# EAGLE design I2C-OneWire_Probes (EAGLE 9.6.2)
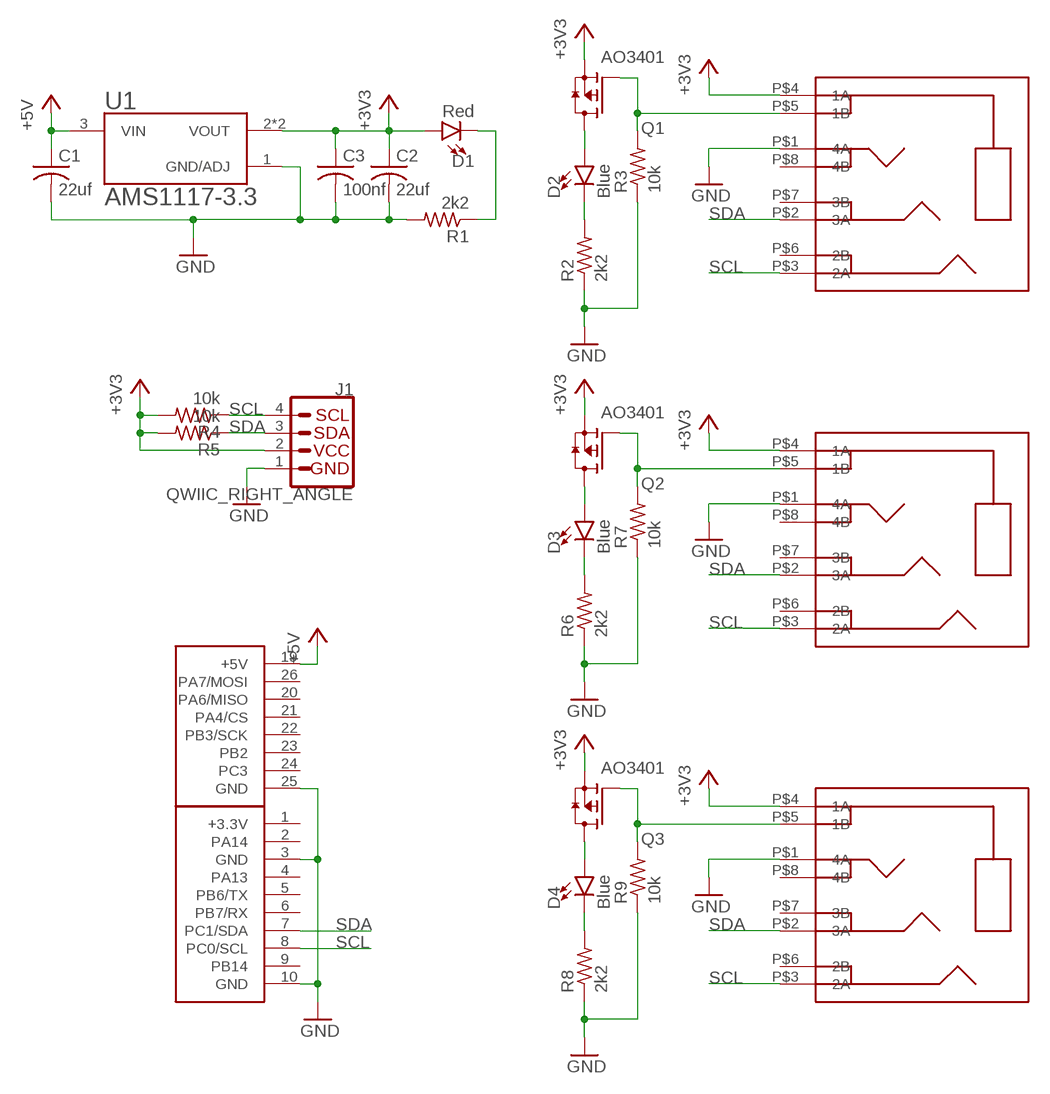
[diagram p0: schematic, sheet 1]

## Parts
C1  22uf  C-USC3216  [C3216]
C2  22uf  C-USC3216  [C3216]
C3  100nf  C-USC0805  [C0805]
D1  Red  LED-RED1206  [LED-1206]
D2  Blue  LED-BLUE1206  [LED-1206]
D3  Blue  LED-BLUE1206  [LED-1206]
D4  Blue  LED-BLUE1206  [LED-1206]
J1  QWIIC_RIGHT_ANGLE  QWIIC_CONNECTORJS-1MM  [JST04_1MM_RA]
Q1  AO3401  [AO3401]
Q2  AO3401  [AO3401]
Q3  AO3401  [AO3401]
R1  2k2  R-US_R0805  [R0805]
R2  2k2  R-US_R0805  [R0805]
R3  10k  R-US_R0805  [R0805]
R4  10k  R-US_R0805  [R0805]
R5  10k  R-US_R0805  [R0805]
R6  2k2  R-US_R0805  [R0805]
R7  10k  R-US_R0805  [R0805]
R8  2k2  R-US_R0805  [R0805]
R9  10k  R-US_R0805  [R0805]
U1  AMS1117-3.3  [SOT229P700X180-4N]
U$1  BOTH-SMD  [BOTH-SMD]
U$2  PJ-3938PJ  [PJ-3938PJ]
U$3  PJ-3938PJ  [PJ-3938PJ]
U$4  PJ-3938PJ  [PJ-3938PJ]

## Nets
+3V3: C2.1 C3.1 D1.A J1.2 Q1.2(S) Q2.2(S) Q3.2(S) R4.2 R5.2 U1.2(VOUT) U1.4(VOUT) U$2.P$4(1A) U$3.P$4(1A) U$4.P$4(1A)
+5V: C1.1 U1.3(VIN) U$1.19(+5V)
GND: C1.2 C2.2 C3.2 J1.1 R1.2 R2.1 R3.1 R6.1 R7.1 R8.1 R9.1 U1.1(GND/ADJ) U$1.3(GND) U$1.10(GND) U$1.25(GND) U$2.P$1(4A) U$3.P$1(4A) U$4.P$1(4A)
N$1: D2.A Q1.3(D)
N$2: D2.C R2.2
N$3: Q1.1(G) R3.2 U$2.P$5(1B)
N$5: D3.C R6.2
N$6: Q2.1(G) R7.2 U$3.P$5(1B)
N$8: D4.C R8.2
N$9: Q3.1(G) R9.2 U$4.P$5(1B)
N$10: D1.C R1.1
N$11: D3.A Q2.3(D)
N$12: D4.A Q3.3(D)
SCL: J1.4 R4.1 U$1.8(PC0/SCL) U$2.P$3(2A) U$3.P$3(2A) U$4.P$3(2A)
SDA: J1.3 R5.1 U$1.7(PC1/SDA) U$2.P$2(3A) U$3.P$2(3A) U$4.P$2(3A)
Unconnected: U$1.1(+3.3V) U$1.2(PA14) U$1.4(PA13) U$1.5(PB6/TX) U$1.6(PB7/RX) U$1.9(PB14) U$1.20(PA6/MISO) U$1.21(PA4/CS) U$1.22(PB3/SCK) U$1.23(PB2) U$1.24(PC3) U$1.26(PA7/MOSI) U$2.P$6(2B) U$2.P$7(3B) U$2.P$8(4B) U$3.P$6(2B) U$3.P$7(3B) U$3.P$8(4B) U$4.P$6(2B) U$4.P$7(3B) U$4.P$8(4B)

## Library data of the parts
C1-C3 = rcl:C-US: CAPACITOR, American symbol; SPICEPREFIX: C
D1 = SparkFun-LED:LED-RED: Red SMD LED Used in manufacturing of most products at SparkFun Packages: 0603 - KB - KingBright (DIO-17976) SMD 0603 package [Datasheet] <https://www.kingbrightusa.com/images/catalog/SPEC/APT1608SURCK.pdf> 0603 - (DIO-00819, has gone EOL) SMD 0603 package 0603 SMART - SMD 0603 SMART package ( more efficient and expensive)[Product Link] <http://www.osram-os.com/Graphics/XPic2/00077099_0.pdf> 1206 - SMD1206 package [Product Link] <https://www.sparkfun.com/datasheets/DevTools/LilyPad/Q150OVS4.pdff> SparkFun Products: Pro Mini 328 -5V <https://www.sparkfun.com/products/821> RedBoard <https://www.sparkfun.com/products/12757> IOIO-OTG <https://www.sparkfun.com/products/13613>; PROD_ID: DIO-09912
D2-D4 = SparkFun-LED:LED-BLUE: Blue SMD LED Used in manufacturing of various products at SparkFun Packages: 0603 - SMD 0603 package [Product Link] <http://www.digikey.com/product-detail/en/SMLE12BC7TT86/511-1589-2-ND/1641808> 1206 - SMD1206 package [Product Link] <http://www.digikey.com/product-detail/en/lite-on-inc/LTST-C150TBKT/160-1643-1-ND/573584> SparkFun Products: ESP8266 Thing-Dev Board <https://www.sparkfun.com/products/13711> RedBoard <https://www.sparkfun.com/products/12757>; PROD_ID: DIO-09911
J1 = SparkFun-Connectors:QWIIC_CONNECTOR: SparkFun I2C Standard Qwiic Connector An SMD 1mm pitch JST connector makes it easy and quick (get it? Qwiic?) to connect I2C devices to each other. The Qwiic system <http://www.sparkfun.com/qwiic> enables fast and solderless connection between popular platforms and various sensors and actuators. We carry 200mm <https://www.sparkfun.com/products/14204>, 100mm <https://www.sparkfun.com/products/14205>, 50mm <https://www.sparkfun.com/products/14206>, and breadboard friendly <https://www.sparkfun.com/products/14207> Qwiic cables. We also offer 10 pcs strips <https://www.sparkfun.com/products/14323> the SMD connectors.; PROD_ID: CONN-13694
Q1-Q3 = DMG2305UX-7:AO3401: DMG2305UX Series 20 V 65 Ohms P-Ch Enhancement Mode Mosfet - SOT-23-3; MANUFACTURER: Diodes Inc.; MAXIMUM_PACKAGE_HEIGHT: 1.1mm; PARTREV: 09/2018; STANDARD: IPC-7351B
R1-R9 = rcl:R-US_: RESISTOR, American symbol; SPICEPREFIX: R
U1 = AMS1117-3.3:AMS1117-3.3: Check availability <https://pricing.snapeda.com/parts/AMS1117-3.3/Advanced%20Monolithic%20Systems/view-part?ref=eda>; AVAILABILITY: Not in stock; CHECK_PRICES: https://www.snapeda.com/parts/AMS1117-3.3/Advanced+Monolithic+Systems/view-part/?ref=eda; DESCRIPTION: Sot223/Pkg 1-Amp 3.3-Volt Low Drop Out Voltage Regulatator; MF: Advanced Monolithic Systems; MP: AMS1117-3.3; PACKAGE: SOT-223 Seeed Technology; PRICE: None; SNAPEDA_LINK: https://www.snapeda.com/parts/AMS1117-3.3/Advanced+Monolithic+Systems/view-part/?ref=snap
U$1 = Flipper-Zero-GPIO-Headers:BOTH-SMD
U$2-U$4 = PJ-3938PJ:PJ-3938PJ

## Board
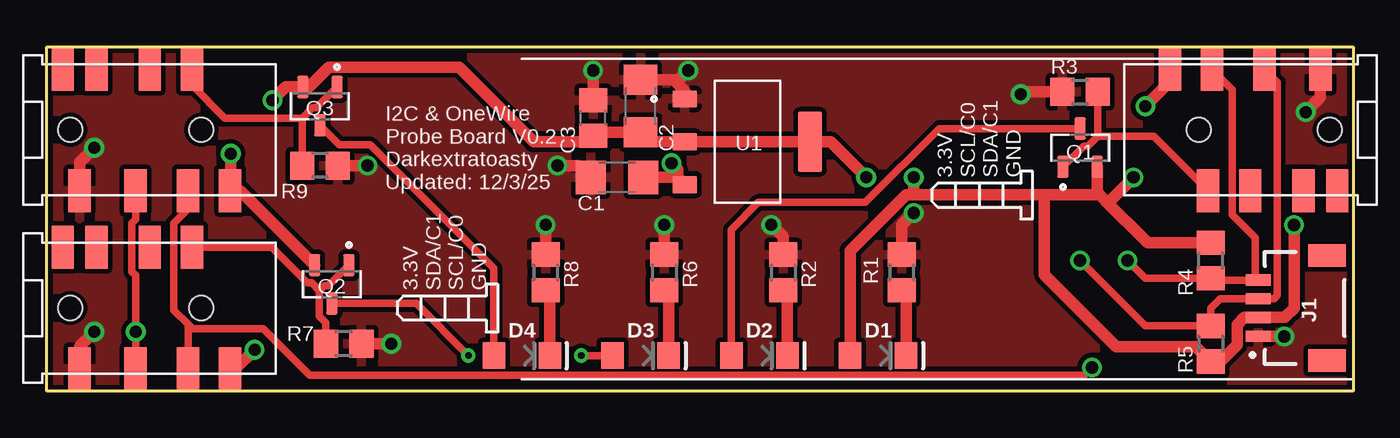
[diagram p1: board, top side]
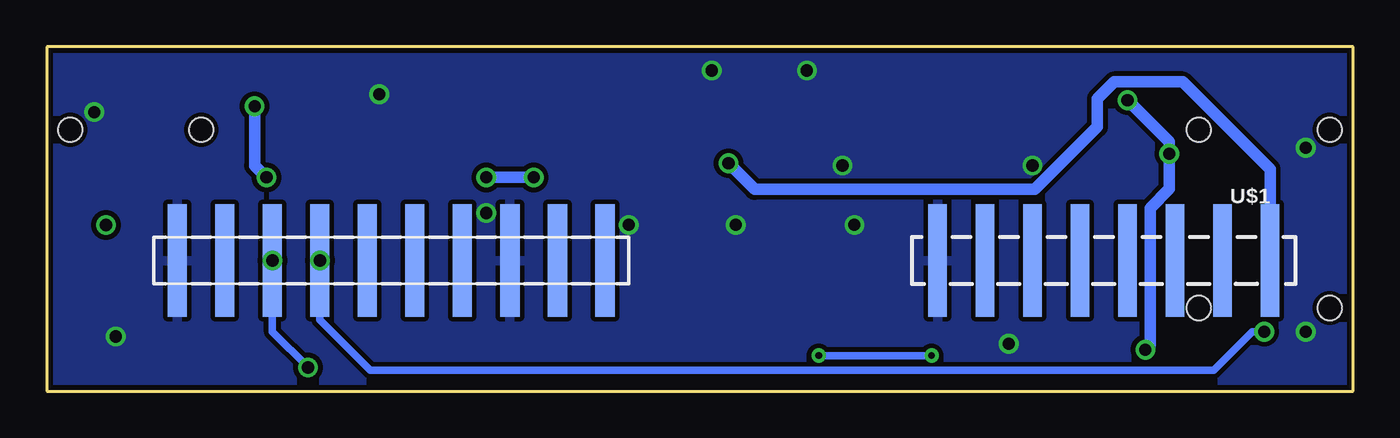
[diagram p2: board, bottom side, seen from below]

Size 69.85 x 18.41 mm. Coordinates in mm from the lower left corner, seen from the top.
Outline: 0,18.41 69.85,18.41 69.85,0 0,0 0,18.41
Copper layers (1*16): Top 0.035mm / dielectric 1.5mm / Bottom 0.035mm
Design rules "default *": minimum track width 6mil, minimum drill 0.35mm, track to track 6mil, track to pad 6mil, pad to pad 6mil, via to via 6mil, smd to smd 6mil, copper to edge 10mil, drill to drill 6mil, minimum pad ring 10mil, minimum via ring 8mil, stop-mask expansion 4mil, vias tented up to drill 0mil, thermal gap 10mil

### Footprints (pad centres in the part's own frame; a part is rotated, then mirrored left to right if it is on the bottom)
C3216 = smd 1.6 x 1.8: 1 -1.4,0; 2 1.4,0
C0805 = smd 1.3 x 1.5: 1 -0.95,0; 2 0.95,0
LED-1206 = smd 1.2 x 1.4: A -1.5,0; C 1.5,0
JST04_1MM_RA = smd 0.6 x 1.35: 1 -1.5,0; 2 -0.5,0; 3 0.5,0; 4 1.5,0 | smd 1.2 x 2: NC1 2.8,-3.675; NC2 -2.8,-3.675
AO3401 = smd 1.18 x 0.61: 1 -1.025,0.915; 2 -1.025,-0.915; 3 1.025,0
R0805 = smd 1.3 x 1.5: 1 -0.95,0; 2 0.95,0
SOT229P700X180-4N = smd 1.31 x 0.93: 1 -3.345,2.29; 2 -3.345,0; 3 -3.345,-2.29 | smd 1.31 x 3.24: 4 3.345,0
BOTH-SMD = smd 1.02 x 6 bottom: 1 7.62,0; 2 10.16,0; 3 12.7,0; 4 15.24,0; 5 17.78,0; 6 20.32,0; 7 22.86,0; 8 25.4,0; 9 27.94,0; 10 30.48,0 | smd 1 x 6 bottom: 19 -27.94,-0.001; 20 -22.86,-0.001; 21 -20.32,0.001; 22 -17.78,-0.001; 23 -15.24,0.001; 24 -12.7,-0.001; 25 -10.16,0.001; 26 -25.4,-0.001
PJ-3938PJ = smd 2.3 x 1.2: P$1 -3.25,6.5; P$2 -3.25,3.5; P$3 -3.25,0.7; P$4 -3.25,-1.55; P$5 3.25,0.5; P$6 3.25,2.75; P$7 3.25,5.6; P$8 3.25,7.4 | hole 1.3: 0,0; 0,7

### Placement (x,y rotation side)
C1  30.48,11.43 180 top
C2  31.75,15.24 90 top
C3  29.21,14.61 90 top
D1  44.45,1.91 0 top
D2  38.1,1.91 0 top
D3  31.75,1.91 0 top
D4  25.4,1.91 0 top
J1  64.77,4.45 90 top
Q1  55.24,13.02 90 top
Q2  15.24,5.71 270 top
Q3  14.61,15.24 270 top
R1  45.72,6.35 90 top
R2  39.37,6.35 270 top
R3  55.24,16 0 top
R4  62.23,6.99 90 top
R5  62.23,2.54 270 top
R6  33.02,6.35 270 top
R7  15.88,2.54 180 top
R8  26.67,6.35 270 top
R9  14.61,12.06 180 top
U1  37.47,13.34 0 top
U$1  32.38,6.99 0 top
U$2  61.59,13.97 270 top
U$3  8.26,4.45 90 top
U$4  8.26,13.97 90 top

### Tracks (layer width: path | path; a pad name or v marks a point on that pad's centre or on a via)
+3V3  (via drill 0.65)
  Top 0.61: R4.2 58.86,7.93 56.58,10.22 | D1.A 42.95,7.51 45.95,10.51 46.35,10.51 | 56.58,10.22 56.29,10.51 | 56.29,10.51 53.34,10.51 | 53.34,10.51 46.35,10.51 | 53.34,10.51 53.34,6.23 57.18,2.38 61.44,2.38 R5.2 62.76,1.59 63.64,2.47 63.64,3.56 64.02,3.94 J1.2 66.2,3.94 66.68,4.43 v66.68,8.89 | v46.35,11.43 46.35,10.51 | v12.06,15.56 12.77,16.27 Q3.2 14.02,16.27 15.07,17.31 22.06,17.31 26.04,13.34 28.89,13.34 C3.1 29.39,13.84 C2.1 32.26,13.34 U1.2 U1.4 41.91,13.34 v43.81,11.43 | Q1.2 56.16,10.64 56.29,10.51 | Q2.2 10.35,10.72 U$4.P$4 9.84,10.76 v9.84,12.7 | U$3.P$4 10.09,1.2 v11.11,2.22 | U$2.P$4 60.05,16.55 v58.74,15.24 | v58.1,11.43 56.89,10.22 56.58,10.22
  Bottom 0.61: v43.81,11.43 v46.35,11.43 | v12.06,15.56 9.84,13.34 v9.84,12.7 9.84,10.81 10.86,9.79 10.86,2.47 v11.11,2.22 | v58.74,15.24 58.74,12.06 v58.1,11.43
+5V  (via drill 0.65)
  Top 0.61: C1.1 33.73,11.43 | 33.73,11.43 U1.3 | v33.4,12.19 33.73,11.86 33.73,11.43
  Bottom 0.61: v33.4,12.19 32,10.79 17.02,10.79 13.69,14.13 13.69,15.65 12.79,16.54 9.12,16.54 4.45,11.87 U$1.19
GND  (via drill 0.65)
  Top 0.61: R1.2 45.72,8.89 v46.35,9.53 | R2.1 39.37,8.26 v38.73,8.89 | R6.1 v33.02,8.89 | R8.1 v26.67,8.89 | R7.1 v18.41,2.54 | R9.1 v17.14,12.06 | R3.1 52.2,16 v52.07,15.88 | J1.1 66.14,2.94 v66.17,2.92 | C1.2 28.45,12.06 v27.3,12.06 | C3.2 v29.21,17.14 | C2.2 33.52,16.64 | U1.1 34.12,16.05 33.52,16.64 | 33.52,16.64 33.78,16.64 v34.29,17.14 | U$4.P$1 1.75,12.23 v2.54,13.02 | U$2.P$1 68.09,15.71 v67.31,14.92 | U$3.P$1 1.75,2.39 v2.54,3.17
  pour Top (isolate 0.254): 0,18.41 69.85,18.41 69.85,0 0,0
  pour Bottom (isolate 0.254): 0,18.73 69.85,18.73 69.85,0 0,0
N$1
  Top 0.406: Q1.3 47.72,14.04 43.77,10.09 38.05,10.09 36.6,8.64 D2.A
N$2
  Top 0.61: D2.C 39.6,5.17 R2.2
N$3
  Top 0.406: Q1.1 55.43,13.1 55.65,13.1 56.2,13.64 | 56.2,13.64 R3.2 | 56.2,13.64 59.18,13.64 U$2.P$5
N$5
  Top 0.61: D3.C 33.25,5.17 R6.2
N$6
  Top 0.406: Q2.1 15.05,5.64 14.83,5.64 14.58,5.38 | 14.58,5.38 14.58,4 14.93,3.65 R7.2 | 14.58,5.38 14.17,5.79 13.92,5.79 12.02,7.7 U$3.P$5
N$8
  Top 0.61: D4.C 26.9,5.17 R8.2
N$9
  Top 0.406: U$4.P$5 7.75,16.38 9.53,14.61 13.65,14.61 | R9.2 13.65,14.61 | 13.65,14.61 13.94,14.89 13.94,14.91 14.2,15.16 14.42,15.16 Q3.1
N$10
  Top 0.61: D1.C 45.95,5.17 R1.1
N$11  (via drill 0.35)
  Top 0.406: Q2.3 19.76,4.69 v22.54,1.91 | v28.57,1.91 D3.A
  Bottom 0.406: v22.54,1.91 v28.57,1.91
N$12
  Top 0.406: Q3.3 15.65,13.17 17.29,13.17 23.9,6.56 D4.A
SCL  (via drill 0.65)
  Top 0.406: U$1.8 58.73,6.04 R4.1 62.32,5.95 J1.4 64.61,6.11 64.61,8.21 63.39,9.42 63.39,16.13 U$2.P$3 | v55.88,1.27 55.46,0.85 14.05,0.85 11.57,3.34 7.8,3.34 7.55,3.58 | 7.55,3.58 U$3.P$3 | U$4.P$3 7.55,9.75 6.8,8.99 6.8,4.33 7.55,3.58
  Bottom 0.406: v55.88,1.27 57.78,3.17 U$1.8
  other vias: 57.78,6.99
SDA  (via drill 0.65)
  Top 0.406: U$1.7 58.74,3.49 R5.1 62.23,4.45 62.73,4.95 J1.3 65.63,4.95 65.8,5.12 65.8,16.51 U$2.P$2 | U$4.P$2 4.75,9.2 4.55,8.99 4.55,6.4 4.75,6.19 v4.75,3.17 U$3.P$2
  Bottom 0.406: U$1.7 55.24,3.81 52.56,1.12 7.45,1.12 5.4,3.17 v4.75,3.17
  other vias: 55.24,6.99

### Text on the board
tNames: I2C & OneWire / Probe Board V0.2 / Darkextratoasty / Updated: 12/3/25 | 3.3V / SCL/C0 / SDA/C1 / GND | 3.3V / SDA/C1 / SCL/C0 / GND